# Altium schematic sheet AlcoholDetectie.SchDoc
size A4
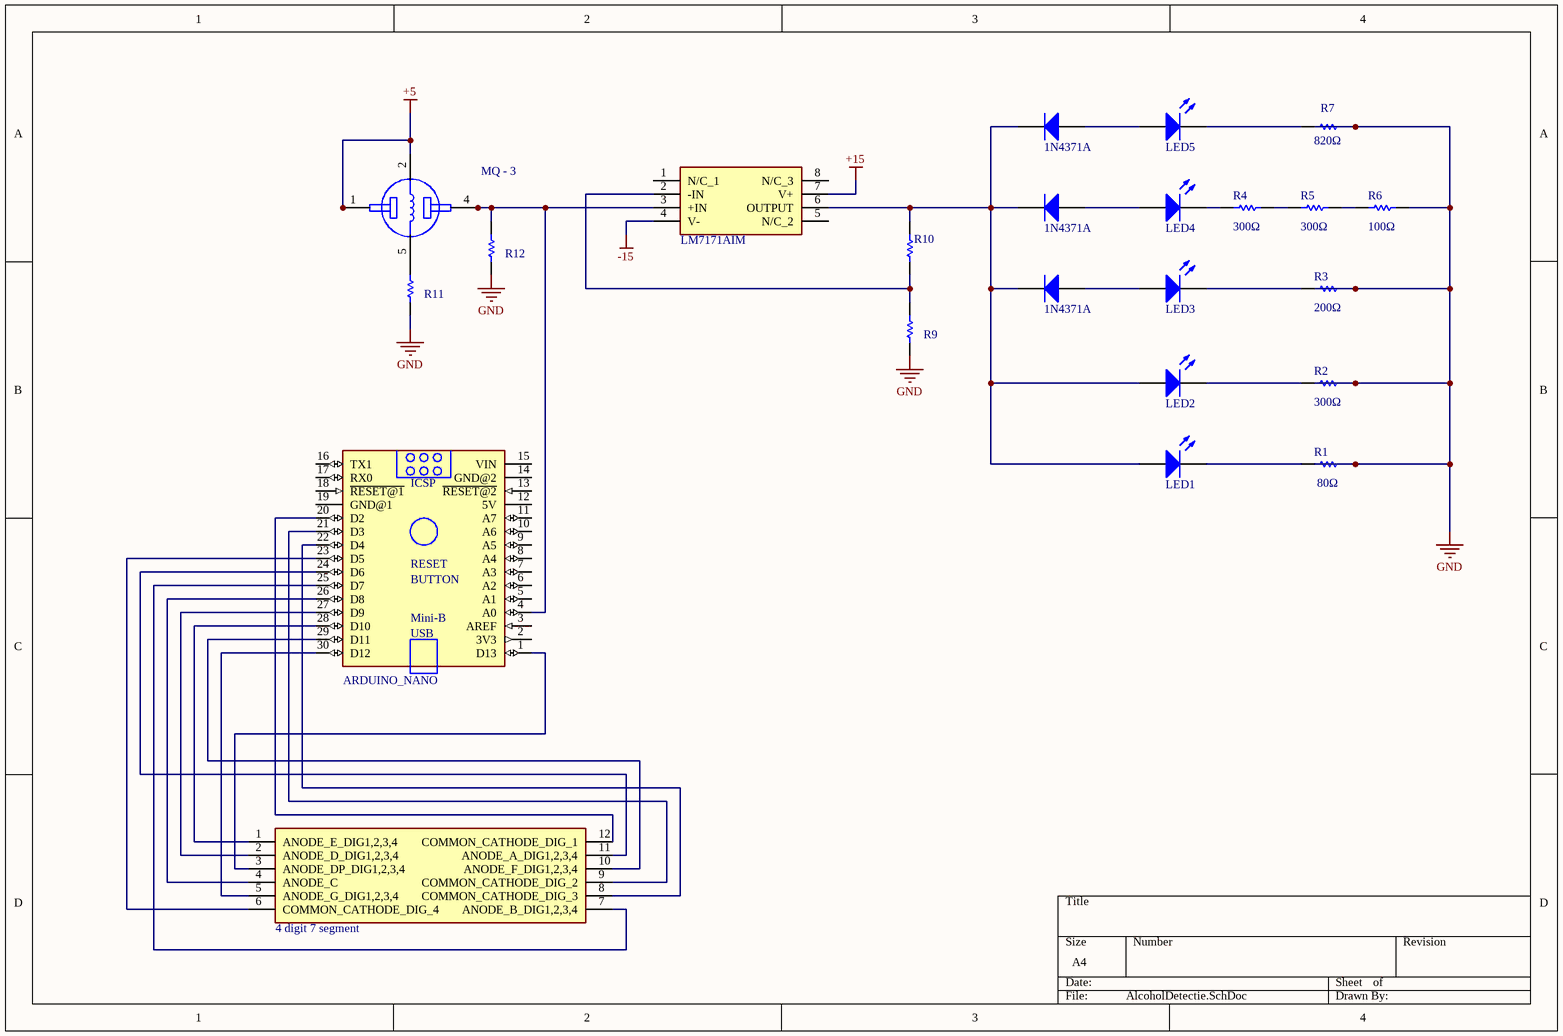
[diagram p0: AlcoholDetectie.SchDoc]

## Parts
(Parts that share a designator on the sheet are numbered #1, #2 ... from top to bottom, then left to right.)
1N4371A  1N4371A  [DO-35]
4_digit_7_segment  CC56-12SRWA  [CC5612SRWA]  (value not drawn)
ARDUINO_NANO  ARDUINO_NANO  [ARDUINO_NANO]  (value not drawn)
COMPERATOR  LM7171AIM  [SOIC127P600X175-8N]
D?#1  1N4371A  [DO-35]
D?#2  1N4371A  [DO-35]
GROEN  LED1  [LED-1]
MQ_-_3  SEN-08880  [XDCR_SEN-08880]  (value not drawn)
ORANJE#1  LED3  [LED-1]
ORANJE#2  LED2  [LED-1]
R1  80Ω  [RESC2013X50X30LL20T20]
R2  300Ω  [RESC2013X50X30LL20T20]
R3  200Ω  [RESC2013X50X30LL20T20]
R4  300Ω  [RESC2013X50X30LL20T20]
R5  300Ω  [RESC2013X50X30LL20T20]
R6  100Ω  [RESC2013X50X30LL20T20]
R7  820Ω  [RESC2013X50X30LL20T20]
R9  1k Ω  [RESC2013X50X30LL20T20]  (value not drawn)
R10  1k Ω  [RESC2013X50X30LL20T20]  (value not drawn)
R11  5,1 Ω  [RESC2013X50X30LL20T20]  (value not drawn)
R12  1k Ω  [RESC2013X50X30LL20T20]  (value not drawn)
ROOD#1  LED5  [LED-1]
ROOD#2  LED4  [LED-1]

## Nets
+5: MQ_-_3.1(A) MQ_-_3.2(H1) MQ_-_3.3(A)
+15: COMPERATOR.7(V+)
-15: COMPERATOR.4(V-)
GND: R1.2 R2.2 R3.2 R6.2 R7.2 R9.1 R11.1 R12.1
Net1N4371A_1: 1N4371A.1(A) ORANJE#1.1(A)
Net1N4371A_2: 1N4371A.2(K) COMPERATOR.6(OUTPUT) D?#1.2(K) D?#2.2(K) GROEN.1(A) ORANJE#2.1(A) R10.2
Net4_digit_7_segment_1: 4_digit_7_segment.1(ANODE_E_DIG1,2,3,4) ARDUINO_NANO.28(D10)
Net4_digit_7_segment_2: 4_digit_7_segment.2(ANODE_D_DIG1,2,3,4) ARDUINO_NANO.27(D9)
Net4_digit_7_segment_3: 4_digit_7_segment.3(ANODE_DP_DIG1,2,3,4) ARDUINO_NANO.1(D13)
Net4_digit_7_segment_4: 4_digit_7_segment.4(ANODE_C) ARDUINO_NANO.26(D8)
Net4_digit_7_segment_5: 4_digit_7_segment.5(ANODE_G_DIG1,2,3,4) ARDUINO_NANO.30(D12)
Net4_digit_7_segment_6: 4_digit_7_segment.6(COMMON_CATHODE_DIG_4) ARDUINO_NANO.23(D5)
Net4_digit_7_segment_7: 4_digit_7_segment.7(ANODE_B_DIG1,2,3,4) ARDUINO_NANO.25(D7)
Net4_digit_7_segment_8: 4_digit_7_segment.8(COMMON_CATHODE_DIG_3) ARDUINO_NANO.22(D4)
Net4_digit_7_segment_9: 4_digit_7_segment.9(COMMON_CATHODE_DIG_2) ARDUINO_NANO.21(D3)
Net4_digit_7_segment_10: 4_digit_7_segment.10(ANODE_F_DIG1,2,3,4) ARDUINO_NANO.29(D11)
Net4_digit_7_segment_11: 4_digit_7_segment.11(ANODE_A_DIG1,2,3,4) ARDUINO_NANO.24(D6)
Net4_digit_7_segment_12: 4_digit_7_segment.12(COMMON_CATHODE_DIG_1) ARDUINO_NANO.20(D2)
NetARDUINO_NANO_4: ARDUINO_NANO.4(A0) COMPERATOR.3(+IN) MQ_-_3.4(B) MQ_-_3.6(B) R12.2
NetCOMPERATOR_2: COMPERATOR.2(-IN) R9.2 R10.1
NetD?#1_1: D?#1.1(A) ROOD#1.1(A)
NetD?#2_1: D?#2.1(A) ROOD#2.1(A)
NetGROEN_2: GROEN.2(K) R1.1
NetMQ_-_3_5: MQ_-_3.5(H2) R11.2
NetORANJE#1_2: ORANJE#1.2(K) R3.1
NetORANJE#2_2: ORANJE#2.2(K) R2.1
NetR4_1: R4.1 ROOD#2.2(K)
NetR4_2: R4.2 R5.1
NetR5_2: R5.2 R6.1
NetR7_1: R7.1 ROOD#1.2(K)

Not connected (* = marked no-connect by the designer): ARDUINO_NANO 2(3V3) 3(AREF) 5(A1) 6(A2) 7(A3) 8(A4) 9(A5) 10(A6) 11(A7) 12(5V) 13(~{RESET@2}) 14(GND@2) 15(VIN) 16(TX1) 17(RX0) 18(~{RESET@1}) 19(GND@1); COMPERATOR 1(N/C_1) 5(N/C_2) 8(N/C_3)

## Notes on the sheet
- (in symbol ARDUINO_NANO) ICSP; RESET; BUTTON; Mini-B; USB

## Library data of the parts
1N4371A D?#1 D?#2 = Diode 1N4148: High Conductance Fast Diode; Published: 8-Jun-2000; LatestRevisionDate: 17-Jul-2002; LatestRevisionNote: Re-released for DXP Platform.; DatasheetVersion: 1997; PackageReference: DO-35; Publisher: Altium Limited; PackageDescription: Diode, Axial; Body 3.8 x 1.9 mm (LxDia. max), Lead Dia. 0.53 mm (max); Code_JEDEC: DO-204-AH; ComponentLink1Description: Manufacturer Link; ComponentLink1URL: http://www.fairchildsemi.com/; ComponentLink2Description: Datasheet; ComponentLink2URL: http://www.fairchildsemi.com/ds/1N%2F1N4148.pdf
4_digit_7_segment = CC56-12SRWA: Display; Manufacturer_Name: Kingbright; Datasheet Link: https://componentsearchengine.com//CC56-12SRWA.pdf; Height: 8.35mm; Mouser2 Part Number: 604-CC56-12SRWA; Mouser2 Price/Stock: https://www.mouser.com/Search/Refine.aspx?Keyword=604-CC56-12SRWA; Manufacturer_Part_Number: CC56-12SRWA
ARDUINO_NANO = ARDUINO_NANO: Small, complete, and breadboard-friendly board based on the ATmega328 (Arduino Nano 3.x); Price: None; SnapEDA_Link: https://www.snapeda.com/parts/Arduino%20Nano/Arduino/view-part/?ref=snap; Check_prices: https://www.snapeda.com/parts/Arduino%20Nano/Arduino/view-part/?ref=eda; Availability: In Stock; Value: *; MP: Arduino Nano; MF: Arduino; Package: Non-Standard Arduino
COMPERATOR = LM7171AIMX_NOPB: Integrated Circuit; Manufacturer_Name: Texas Instruments; Manufacturer_Part_Number: LM7171AIMX/NOPB; Datasheet Link: http://www.ti.com/lit/gpn/LM7171; Height: 1.75mm; Mouser2 Part Number: 926-LM7171AIMX/NOPB; Mouser2 Price/Stock: https://www.mouser.com/Search/Refine.aspx?Keyword=926-LM7171AIMX%2FNOPB
GROEN ORANJE#1 ORANJE#2 ROOD#1 ROOD#2 = LED1: Typical RED GaAs LED; Published: 8-Jun-2000; LatestRevisionDate: 08-Jul-2005; LatestRevisionNote: Mech Layer 1 removed.; PackageReference: LED-1; Publisher: Altium Limited; PackageDescription: LED; 2 Leads
MQ_-_3 = SEN-08880: Alcohol _C2H6O_ Sensor 0 V ~ 3.3 V; MF: SparkFun Electronics; Availability: Unavailable; Package: None; Price: None; SnapEDA_Link: https://www.snapeda.com/parts/SEN-08880/SparkFun%20Electronics/view-part/1160647/?ref=snap; Value: *; MP: SEN-08880
R1-R7 R9-R12 = CMP-2001-04896-1: Manufacturer: Vishay Dale; Part Number: CRCW08050000Z0EA